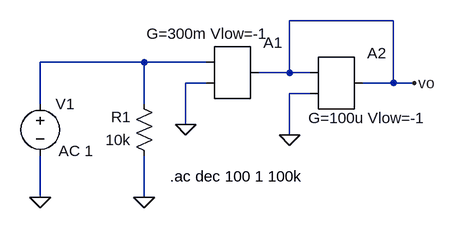
[diagram p0: schematic Ej_1_c.asc]
Ej_1_c.asc, the LTspice schematic file:
Version 4
SHEET 1 880 680
WIRE 288 32 128 32
WIRE -96 96 -256 96
WIRE 0 96 -96 96
WIRE 128 112 128 32
WIRE 128 112 80 112
WIRE 160 112 128 112
WIRE 0 128 -32 128
WIRE 288 128 288 32
WIRE 288 128 240 128
WIRE 320 128 288 128
WIRE 160 144 128 144
WIRE -256 160 -256 96
WIRE -96 160 -96 96
WIRE -32 192 -32 128
WIRE 128 208 128 144
WIRE -256 304 -256 240
WIRE -96 304 -96 240
FLAG -256 304 0
FLAG -96 304 0
FLAG -32 192 0
FLAG 128 208 0
FLAG 320 128 vo
SYMBOL res -80 256 R180
WINDOW 0 36 76 Left 2
WINDOW 3 36 40 Left 2
SYMATTR InstName R1
SYMATTR Value 10k
SYMBOL voltage -256 144 R0
WINDOW 3 24 152 Left 2
WINDOW 123 28 89 Left 2
WINDOW 39 0 0 Left 0
SYMATTR Value ""
SYMATTR Value2 AC 1
SYMATTR InstName V1
SYMBOL SpecialFunctions\\ota 32 48 R0
WINDOW 3 -124 4 Left 2
SYMATTR InstName A1
SYMATTR Value G=300m Vlow=-1
SYMBOL SpecialFunctions\\ota 192 64 R0
WINDOW 3 -35 118 Left 2
SYMATTR InstName A2
SYMATTR Value G=100u Vlow=-1
TEXT -56 272 Left 2 !.ac dec 100 1 100k

The netlist it stands for:
* Ej_1_c.asc
R1 0 N001 10k
V1 N001 0 AC 1
A1 N001 0 0 0 0 0 vo 0 OTA G=300m Vlow=-1
A2 vo 0 0 0 0 0 vo 0 OTA G=100u Vlow=-1
.ac dec 100 1 100k
.backanno
.end